# EasyEDA schematic SCH_TV-Dynamic-Audio-Control_2026-10-04.json
TITLE: TV Dynamic Audio Control System; REV: 10.1; Date: 2026-09-27; Sheet: 1/1; Drawn By: Picco; Company: personal/hobby electronics
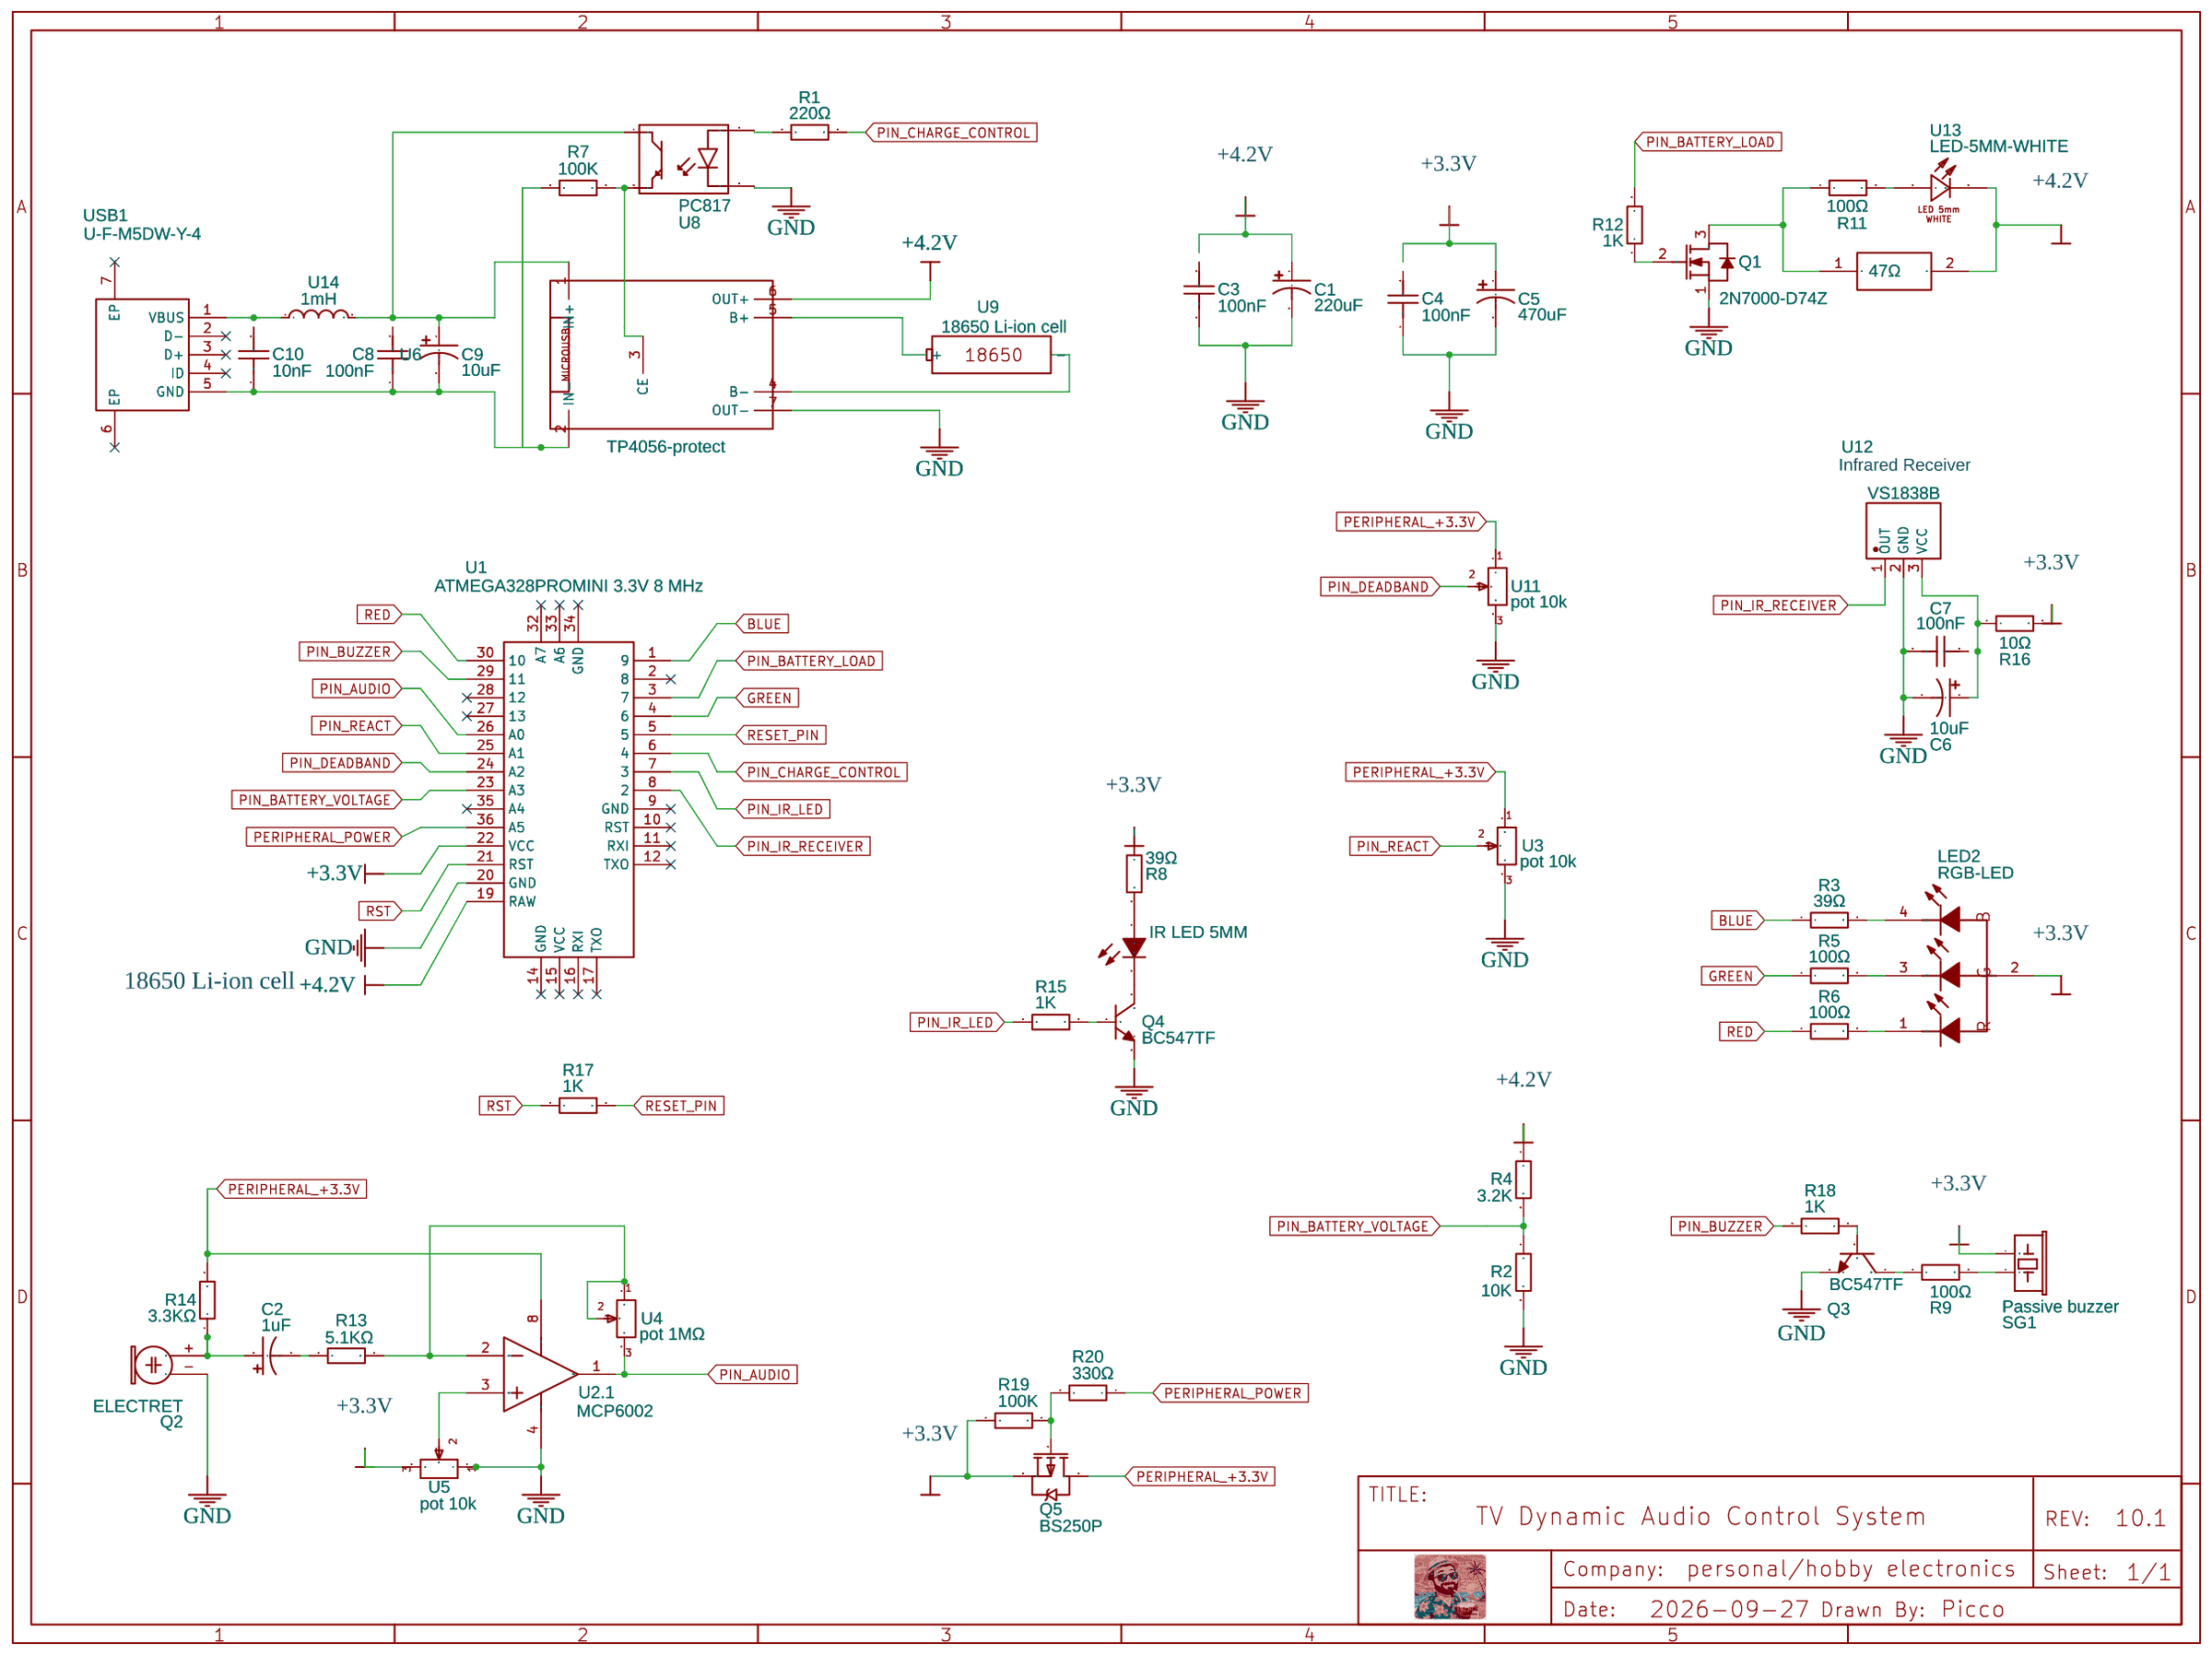
[diagram p0: schematic sheet]

## Parts
C1  220uF  [CPOL-RADIAL-100UF-25V]
C2  1uF  [CPOL-RADIAL-100UF-25V]
C3  100nF  [CK05]
C4  100nF  [CK05]
C5  470uF  [CPOL-RADIAL-100UF-25V]
C6  10uF  [CPOL-RADIAL-100UF-25V]
C7  100nF  [CK05]
C8  100nF  [CK05]
C9  10uF  [CPOL-RADIAL-100UF-25V]
C10  10nF  [CK05]
LED1  IR LED 5MM  [LED-TH_BD5.0-P2.54-FD_C9900023552]
LED2  RGB-LED  [LED-TH_4P-BD5.8-P1.30]
Q1  2N7000-D74Z  [TO-92-3_L4.8-W3.7-P2.54-L]
Q2  ELECTRET  [9.7ELECTRET]
Q3  BC547TF  [TO-92-3_L4.8-W3.7-P1.27-L-1]
Q4  BC547TF  [TO-92-3_L4.8-W3.7-P1.27-L-1]
Q5  BS250P  [TO-92L-3_L5.2-W2.5-P1.27-L_BS250P]
R1  220Ω  [AXIAL-0.6]
R2  10K  [AXIAL-0.6]
R3  39Ω  [AXIAL-0.6]
R4  3.2K  [AXIAL-0.6]
R5  100Ω  [AXIAL-0.6]
R6  100Ω  [AXIAL-0.6]
R7  100K  [AXIAL-0.6]
R8  39Ω  [AXIAL-0.6]
R9  100Ω  [AXIAL-0.6]
R10  47Ω  [RESISTOR 1WATT]
R11  100Ω  [AXIAL-0.6]
R12  1K  [AXIAL-0.6]
R13  5.1KΩ  [AXIAL-0.6]
R14  3.3KΩ  [AXIAL-0.6]
R15  1K  [AXIAL-0.6]
R16  10Ω  [AXIAL-0.6]
R17  1K  [AXIAL-0.6]
R18  1K  [AXIAL-0.6]
R19  100K  [AXIAL-0.6]
R20  330Ω  [AXIAL-0.6]
SG1  Passive buzzer  [BUZZER-12MM-KIT]
U1  ATMEGA328PROMINI 3.3V 8 MHz  [ATMEGA328PROMINI]
U2  MCP6002  [MCP6002]  (section 1)
U3  pot 10k  [POT 10K]
U4  pot 1MΩ  [POT 10K]
U5  pot 10k  [POT 10K]
U6  TP4056-protect  [TP4056-PROTECT]
U8  PC817  [ASDAS]
U9  18650 Li-ion cell  [BAT-TH_MY-18650-01-2]
U11  pot 10k  [POT 10K]
U12  VS1838B  [OPTO-TH_VS1838B]
U13  LED-5MM-WHITE  [FP_LED-5MM-WHITE]
U14  1mH  [IND-TH_XR050125T221MHL5]
USB1  U-F-M5DW-Y-4  [MICRO-USB-SMD_MICRO-USB-A12]

## Library data of the parts
C1 C2 C5 C6 C9 = CAP_POLPTH1: Capacitor Polarized; Contributor: SparkFun
C3 C4 C7 C8 C10 = 100NF
LED1 = LED_5MM: Contributor: lcsc; Supplier: LCSC; Supplier Part: C9900023552; Manufacturer: null; JLCPCB Part Class: Extended Part
LED2 = RGB-LED: Contributor: lcsc; Supplier: LCSC; Supplier Part: C9900023016; Manufacturer: null; JLCPCB Part Class: Extended Part
Q1 = 2N7000-D74Z: Contributor: LCSC; Supplier: LCSC; Supplier Part: C900717; Manufacturer: onsemi(安森美); JLCPCB Part Class: Extended Part
Q2 = ELECTRET: Contributor: Adafruit
Q3 Q4 = BC547TF: Supplier: LCSC; Supplier Part: C3201731; Manufacturer: onsemi(安森美); JLCPCB Part Class: Extended Part; Contributor: lcsc
Q5 = BS250P: Contributor: LCSC; Supplier: LCSC; Manufacturer: DIODES(美台); Supplier Part: C151450; JLCPCB Part Class: Extended Part
R1-R9 R11-R20 = RESISTOR 1/2 W: Supplier: LCSC; Supplier Part: C348838; Manufacturer: ResistorToday; Manufacturer Part: EWWR0001J20R0T9; Contributor: LCSC
R10 = resistor 1w: Manufacturer: azz teknik; Supplier: azz teknik; Supplier Part: azz teknik resistor 1w; link: https://www.futurlec.com/Resistors/Res1W_Technical.shtml; Contributor: azismaulana234765
SG1 = BUZZER: Contributor: SparkFun
U1 = ATMEGA328PROMINI 5V: Contributor: eb2sigma9
U2 = MCP6002 COPY: Supplier Part: C116706; Manufacturer: MICROCHIP; Manufacturer Part: MCP6002-I/SN; Operating Temperature: -40°C ~ 85°C; subpart_no: 1; JLCPCB Part Class: Extended Part; Contributor: mengrie
U3-U5 U11 = pot 10k: Contributor: zoloo
U6 = TP4056-protect_v2: link: https://dlnmh9ip6v2uc.cloudfront.net/datasheets/Prototyping/TP4056.pdf; Contributor: Egorov
U8 = OPTOCOUPLERPC817: Supplier: opto; Contributor: dineshkarthic.v.m.1997; sim: true
U9 = 18650 COPY: catid: 20; Contributor: Stepan.Electronix; Manufacturer Part: 18650; sim: true
U12 = VS1838B: Contributor: LCSC; Supplier: LCSC; Supplier Part: C9900002107; Manufacturer: null; JLCPCB Part Class: Extended Part
U13 = SB_LED-5MM-WHITE: Contributor: viniciusantunes
U14 = XR050125TS330MHL9: Supplier: LCSC; Supplier Part: C18213946; Manufacturer: XR(祥如); JLCPCB Part Class: Extended Part; Contributor: lcsc
USB1 = U-F-M5DW-Y-4: Contributor: LCSC; Supplier: LCSC; Manufacturer: 韩国韩荣; Supplier Part: C145784; JLCPCB Part Class: Extended Part

## Nets
+3.3V: C4.2 C5.1(+) LED2.2(CA) Q5.1(S) R8.1 R16.2 R19.2 SG1.-(2) U1.22(VCC) U5.3
+4.2V: C1.1(+) C3.2 R4.1 R10.2 U1.19(RAW) U6.6(OUT+) U13.2
GND: C1.2(-) C3.1 C4.1 C5.2(-) C6.2(-) C7.1 Q1.1(S) Q2.-(1) Q3.3(E) Q4.3(E) R2.2 U1.20(GND) U2.4(VSS) U3.3 U5.1 U6.7(OUT-) U8.2(B) U11.3 U12.2(GND)
BLUE: R3.1 U1.1(9)
GREEN: R5.1 U1.4(6)
PERIPHERAL_+3.3V: Q5.3(D) R14.2 U2.8(VDD) U3.1 U11.1
PERIPHERAL_POWER: R20.1 U1.36(A5)
PIN_AUDIO: U1.26(A0) U2.1(VOUTB) U4.3
PIN_BATTERY_LOAD: R12.2 U1.3(7)
PIN_BATTERY_VOLTAGE: R2.1 R4.2 U1.23(A3)
PIN_BUZZER: R18.1 U1.29(11)
PIN_CHARGE_CONTROL: R1.2 U1.6(4)
PIN_DEADBAND: U1.24(A2) U11.2
PIN_IR_LED: R15.1 U1.7(3)
PIN_IR_RECEIVER: U1.8(2) U12.1(OUT)
PIN_REACT: U1.25(A1) U3.2
RED: R6.1 U1.30(10)
RESET_PIN: R17.2 U1.5
RST: R17.1 U1.21(RST)
Net-(C2-1): C2.1(+) Q2.+(2) R14.1
Net-(C2-2): C2.2(-) R13.1
Net-(C6-1): C6.1(+) C7.2 R16.1 U12.3(VCC)
Net-(C8-1): C8.1 C9.2(-) C10.1 R7.2 U6.2(IN-) USB1.5(GND)
Net-(C8-2): C8.2 C9.1(+) U6.1(IN+) U8.4(D) U14.2
Net-(C10-2): C10.2 U14.1 USB1.1(VBUS)
Net-(LED1-1): LED1.1(A) R8.2
Net-(LED1-2): LED1.2(K) Q4.1(C)
Net-(LED2-1): LED2.1(KR) R6.2
Net-(LED2-3): LED2.3(KG) R5.2
Net-(LED2-4): LED2.4(KB) R3.2
Net-(Q1-2): Q1.2(G) R12.1
Net-(Q1-3): Q1.3(D) R10.1 R11.1
Net-(Q3-1): Q3.1(C) R9.1
Net-(Q3-2): Q3.2(B) R18.2
Net-(Q4-2): Q4.2(B) R15.2
Net-(Q5-2): Q5.2(G) R19.1 R20.2
Net-(R1-1): R1.1 U8.1(A)
Net-(R7-1): R7.1 U6.3(CE) U8.3(C)
Net-(R9-2): R9.2 SG1.+(1)
Net-(R11-2): R11.2 U13.1
Net-(R13-2): R13.2 U2.2(VINB-) U4.1 U4.2
Net-(U2.1-3): U2.3(VINB+) U5.2
Net-(U6-4): U6.4(B-) U9.1(-)
Net-(U6-5): U6.5(B+) U9.2(+)

Not connected (* = marked no-connect by the designer): U1 2(8)* 9(GND)* 10(RST)* 11(RXI)* 12(TXO)* 14(GND)* 15(VCC)* 16(RXI)* 17(TXO)* 27(13)* 28(12)* 32(A7)* 33(A6)* 34(GND)* 35(A4)*; USB1 2(D-)* 3(D+)* 4(ID)* 6(EP)* 7(EP)*

## Notes on the sheet
- Infrared Receiver
- 18650 Li-ion cell
